# EasyEDA Pro project keyboard_hewis.epro, board Cockpit
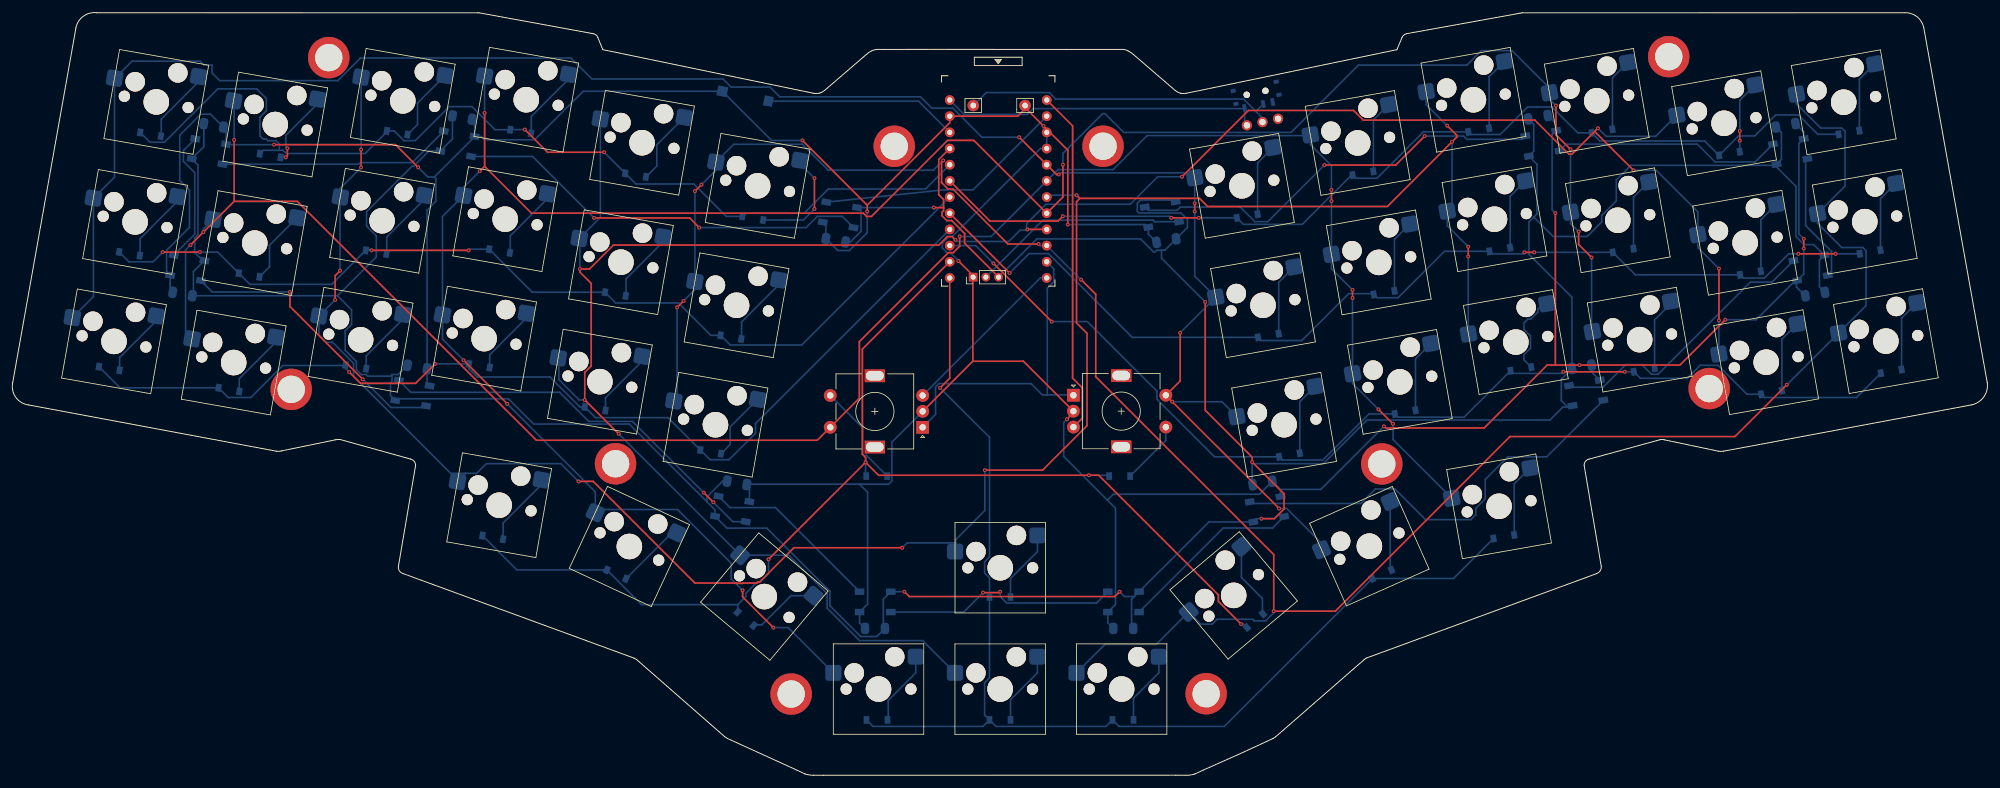
[diagram p2: board, top side]
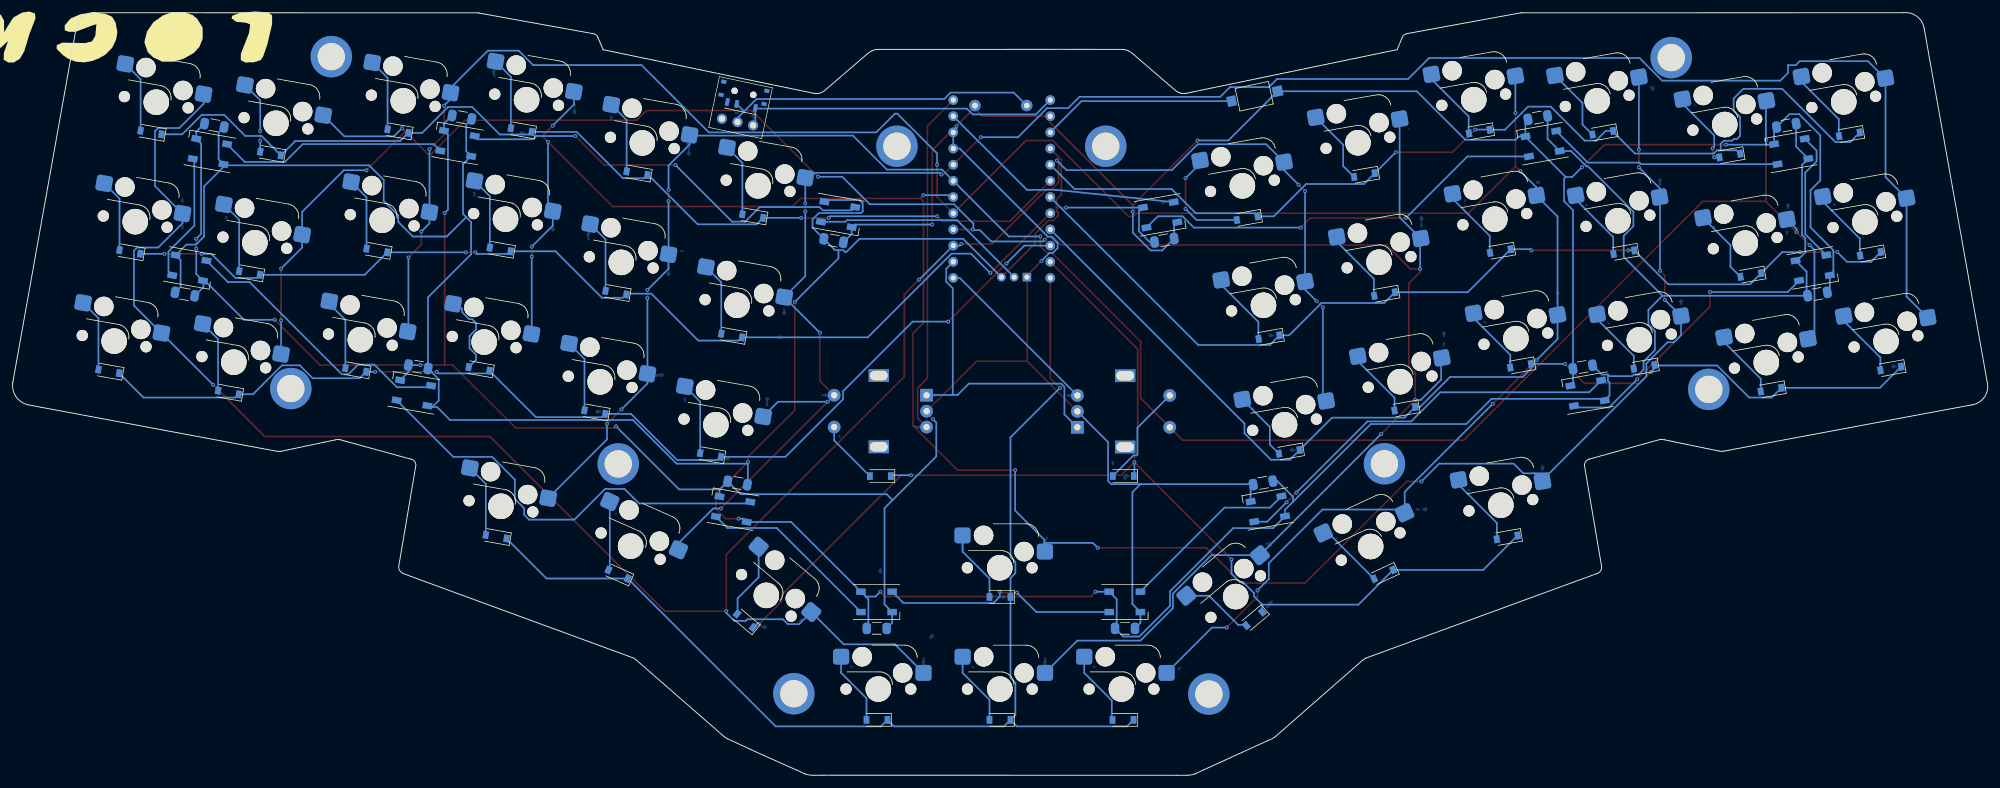
[diagram p3: board, bottom side, seen from below]

Outline 309.97 x 119.78 mm; copper layers: Top Layer, Bottom Layer. Coordinates in mm from the lower left corner of the outline.
Outline path: 2.49,58.17 arc(0.51,59.41) 0.07,61.7 9.99,117.41 arc(11.16,119.22) 13.25,119.76 73,119.75 73.26,119.75 91.15,116.47 arc(91.58,116.29) 91.87,115.92 92.68,113.96 125.75,107.11 arc(126.21,107.07) 126.67,107.13 arc(127.08,107.29) 127.45,107.53 134.02,113.19 arc(134.43,113.52) 134.9,113.79 arc(135.36,113.94) 135.84,114 136.86,114 144.66,114.01 165.44,114 174.13,114 arc(174.61,113.95) 175.07,113.79 arc(175.53,113.52) 175.95,113.19 182.52,107.53 arc(182.9,107.28) 183.33,107.11 arc(183.77,107.07) 184.22,107.11 217.29,113.96 218.1,115.87 arc(218.39,116.26) 218.82,116.47 236.65,119.69 236.97,119.75 297.02,119.76 arc(298.93,119.13) 299.98,117.41 309.94,61.66 arc(309.4,59.42) 307.47,58.17 268.51,50.89 arc(268.13,50.87) 267.75,50.89 259.27,52.68 arc(258.89,52.74) 258.51,52.68 247.48,49.66 arc(246.9,49.32) 246.68,48.68 249.36,32.82 arc(249.2,32.13) 248.64,31.68 212.48,18.4 212.06,18.08 198.27,6.05 197.89,5.8 192.45,3.28 186.89,0.81 185.58,0.2 arc(184.89,0.04) 184.18,0 182.6,0.01 127.34,0 125.79,0 arc(125.08,0.05) 124.39,0.21 123.12,0.81 112.23,5.78 111.81,6.06 97.98,18.17 97.55,18.41 61.33,31.68 arc(60.74,32.13) 60.61,32.87 63.29,48.68 arc(63.06,49.32) 62.49,49.66 51.46,52.72 arc(51.08,52.74) 50.7,52.68 42.22,50.94 arc(41.84,50.87) 41.46,50.9 2.49,58.17
Stack: Top Layer 0.0009mm / dielectric 1 0.0384mm FR4 er 4.5 / Bottom Layer 0.0009mm

## Design rules (mm)
spacing safeClearance (default): track to track 0.152, other pairs 0.152 to 0.3
track width trackWidth (default): min 0.127, default 0.254, max 2.54
differential pair differentialPair (default): width min 0.127, default 0.254, max 2.54; gap min 0.152, default 0.152
via viaSize (default): diameter min 0.5, default 0.61, max 10; hole min 0.3, default 0.305, max 6
net COL3 uses CopperRegion517
net ROW6 uses CopperRegion506
net Net-(J2-Pad1) uses CopperRegion393
net COL2 uses CopperRegion507
net RAW uses CopperRegion371
net COL1 uses CopperRegion491
net COL5 uses CopperRegion503
net RST uses CopperRegion444
net COL0 uses CopperRegion471
net Net-(D38-Pad2) uses CopperRegion384
net ROW5 uses CopperRegion438
net COL4 uses CopperRegion482
net ROW0 uses CopperRegion509
net D3 uses CopperRegion355
net ROW1 uses CopperRegion514
net ROW4 uses CopperRegion515
net ROW7 uses CopperRegion502
net D2 uses CopperRegion419
net DOUT uses CopperRegion493
net ROW3 uses CopperRegion485
net ROW2 uses CopperRegion513
net GND uses CopperRegion111
net VCC uses CopperRegion511
net Net-(D33-Pad2) uses CopperRegion294
net Net-(D4-Pad2) uses CopperRegion504
net Net-(D14-Pad2) uses CopperRegion167
net Net-(D28-Pad2) uses CopperRegion210
net Net-(D25-Pad2) uses CopperRegion228
net Net-(LED8-Pad2) uses CopperRegion290
net Net-(LED3-Pad2) uses CopperRegion310
net Net-(D19-Pad2) uses CopperRegion490
net Net-(D46-Pad2) uses CopperRegion293
net Net-(D17-Pad2) uses CopperRegion462
net Net-(D43-Pad2) uses CopperRegion353
net Net-(LED4-Pad2) uses CopperRegion499
net B4 uses CopperRegion436
net Net-(D30-Pad2) uses CopperRegion356
net Net-(D15-Pad2) uses CopperRegion501
net Net-(D24-Pad2) uses CopperRegion257
net Net-(LED12-Pad2) uses CopperRegion318
net Net-(D7-Pad2) uses CopperRegion410
net Net-(LED10-Pad2) uses CopperRegion373
net Net-(D1-Pad2) uses CopperRegion279
net Net-(LED7-Pad2) uses CopperRegion241
net Net-(D12-Pad2) uses CopperRegion272
net Net-(D48-Pad2) uses CopperRegion320
net Net-(D35-Pad2) uses CopperRegion285
net Net-(LED11-Pad2) uses CopperRegion466
net Net-(LED5-Pad2) uses CopperRegion483
net Net-(LED13-Pad2) uses CopperRegion251
net Net-(D36-Pad2) uses CopperRegion344
net Net-(D5-Pad2) uses CopperRegion447
net Net-(D20-Pad2) uses CopperRegion467
net Net-(D31-Pad2) uses CopperRegion337
net Net-(D26-Pad2) uses CopperRegion327
net Net-(LED10-Pad4) uses CopperRegion339
net Net-(D47-Pad2) uses CopperRegion232
net Net-(D39-Pad2) uses CopperRegion488
net Net-(D32-Pad2) uses CopperRegion431
net Net-(D45-Pad2) uses CopperRegion382
net Net-(D10-Pad2) uses CopperRegion246
net Net-(D44-Pad2) uses CopperRegion335
net Net-(D22-Pad2) uses CopperRegion305
net Net-(D8-Pad2) uses CopperRegion454
net Net-(LED1-Pad2) uses CopperRegion324
net Net-(D27-Pad2) uses CopperRegion306
net Net-(D9-Pad2) uses CopperRegion401
net Net-(D21-Pad2) uses CopperRegion400
net Net-(LED6-Pad2) uses CopperRegion346
net Net-(D42-Pad2) uses CopperRegion407
net Net-(D40-Pad2) uses CopperRegion430
net Net-(D23-Pad2) uses CopperRegion457
net Net-(D6-Pad2) uses CopperRegion480
net Net-(D18-Pad2) uses CopperRegion425
net B5 uses CopperRegion481
net Net-(LED2-Pad2) uses CopperRegion477
net Net-(D11-Pad2) uses CopperRegion443
net Net-(D41-Pad2) uses CopperRegion363
net Net-(D37-Pad2) uses CopperRegion381
net Net-(D2-Pad2) uses CopperRegion487
net Net-(D3-Pad2) uses CopperRegion440
net Net-(D16-Pad2) uses CopperRegion508
net Net-(D34-Pad2) uses CopperRegion516
net Net-(D29-Pad2) uses CopperRegion475
net Net-(D13-Pad2) uses CopperRegion426
pour ie2712 uses CopperRegion162
pour ie2713 uses CopperRegion200
pour ie2714 uses CopperRegion436
pour ie2715 uses CopperRegion317
pour ie2723 uses CopperRegion160
pour ie2726 uses CopperRegion220
pour ie2727 uses CopperRegion227
pour ie2728 uses CopperRegion248
pour ie2730 uses CopperRegion309
pour ie2740 uses CopperRegion471
pour ie2753 uses CopperRegion185
pour ie2754 uses CopperRegion187
pour ie2755 uses CopperRegion193
pour ie2757 uses CopperRegion235
pour ie2758 uses CopperRegion252
pour ie2759 uses CopperRegion323
pour ie2760 uses CopperRegion343
pour ie2761 uses CopperRegion351
pour ie2765 uses CopperRegion403
pour ie2768 uses CopperRegion459
pour ie2770 uses CopperRegion491
pour ie2783 uses CopperRegion112
pour ie2785 uses CopperRegion263
pour ie2787 uses CopperRegion283
pour ie2789 uses CopperRegion348
pour ie2791 uses CopperRegion388
pour ie2792 uses CopperRegion402
pour ie2793 uses CopperRegion411
pour ie2794 uses CopperRegion413
pour ie2797 uses CopperRegion473
pour ie2798 uses CopperRegion474
pour ie2799 uses CopperRegion478
pour ie2800 uses CopperRegion507
pour ie2813 uses CopperRegion118
pour ie2815 uses CopperRegion172
pour ie2819 uses CopperRegion261
pour ie2820 uses CopperRegion286
pour ie2821 uses CopperRegion287
pour ie2828 uses CopperRegion489
pour ie2829 uses CopperRegion498
pour ie2842 uses CopperRegion126
pour ie2844 uses CopperRegion146
pour ie2845 uses CopperRegion211
pour ie2846 uses CopperRegion231
pour ie2847 uses CopperRegion231
pour ie2848 uses CopperRegion231
pour ie2849 uses CopperRegion234
pour ie2853 uses CopperRegion301
pour ie2855 uses CopperRegion405
pour ie2857 uses CopperRegion420
pour ie2867 uses CopperRegion119
pour ie2870 uses CopperRegion250
pour ie2873 uses CopperRegion277
pour ie2875 uses CopperRegion347
pour ie2878 uses CopperRegion391
pour ie2881 uses CopperRegion484
pour ie2882 uses CopperRegion503
pour ie2885 uses CopperRegion416
pour ie2886 uses CopperRegion419
pour ie2889 uses CopperRegion114
pour ie2894 uses CopperRegion265
pour ie2895 uses CopperRegion292
pour ie2898 uses CopperRegion279
pour ie2902 uses CopperRegion246
pour ie2906 uses CopperRegion272
pour ie2907 uses CopperRegion424
pour ie2908 uses CopperRegion426
pour ie2909 uses CopperRegion123
pour ie2910 uses CopperRegion167
pour ie2911 uses CopperRegion152
pour ie2912 uses CopperRegion501
pour ie2913 uses CopperRegion399
pour ie2914 uses CopperRegion508
pour ie2915 uses CopperRegion144
pour ie2917 uses CopperRegion315
pour ie2919 uses CopperRegion139
pour ie2920 uses CopperRegion490
pour ie2921 uses CopperRegion365
pour ie2922 uses CopperRegion487
pour ie2923 uses CopperRegion207
pour ie2924 uses CopperRegion467
pour ie2925 uses CopperRegion289
pour ie2926 uses CopperRegion400
pour ie2929 uses CopperRegion308
pour ie2930 uses CopperRegion457
pour ie2931 uses CopperRegion153
pour ie2933 uses CopperRegion125
pour ie2936 uses CopperRegion327
pour ie2937 uses CopperRegion282
pour ie2938 uses CopperRegion306
pour ie2939 uses CopperRegion124
pour ie2940 uses CopperRegion210
pour ie2941 uses CopperRegion423
pour ie2943 uses CopperRegion380
pour ie2944 uses CopperRegion440
pour ie2945 uses CopperRegion150
pour ie2946 uses CopperRegion356
pour ie2947 uses CopperRegion208
pour ie2948 uses CopperRegion337
pour ie2949 uses CopperRegion229
pour ie2953 uses CopperRegion408
pour ie2955 uses CopperRegion183
pour ie2959 uses CopperRegion361
pour ie2960 uses CopperRegion381
pour ie2963 uses CopperRegion370
pour ie2964 uses CopperRegion384
pour ie2965 uses CopperRegion226
pour ie2966 uses CopperRegion488
pour ie2968 uses CopperRegion504
pour ie2969 uses CopperRegion303
pour ie2970 uses CopperRegion430
pour ie2971 uses CopperRegion341
pour ie2972 uses CopperRegion363
pour ie2973 uses CopperRegion300
pour ie2974 uses CopperRegion407
pour ie2975 uses CopperRegion147
pour ie2976 uses CopperRegion353
pour ie2977 uses CopperRegion247
pour ie2979 uses CopperRegion239
pour ie2980 uses CopperRegion382
pour ie2981 uses CopperRegion140
pour ie2982 uses CopperRegion293
pour ie2983 uses CopperRegion216
pour ie2984 uses CopperRegion232
pour ie2985 uses CopperRegion178
pour ie2986 uses CopperRegion320
pour ie2988 uses CopperRegion447
pour ie2989 uses CopperRegion313
pour ie2991 uses CopperRegion163
pour ie2992 uses CopperRegion410
pour ie2993 uses CopperRegion260
pour ie2994 uses CopperRegion454
pour ie2995 uses CopperRegion288
pour ie2996 uses CopperRegion401
pour ie2999 uses CopperRegion393
pour ie3000 uses CopperRegion266
pour ie3001 uses CopperRegion324
pour ie3002 uses CopperRegion166
pour ie3003 uses CopperRegion373
pour ie3004 uses CopperRegion214
pour ie3005 uses CopperRegion339
pour ie3006 uses CopperRegion189
pour ie3007 uses CopperRegion466
pour ie3008 uses CopperRegion155
pour ie3009 uses CopperRegion318
pour ie3010 uses CopperRegion191
pour ie3011 uses CopperRegion251
pour ie3012 uses CopperRegion325
pour ie3013 uses CopperRegion477
pour ie3014 uses CopperRegion132
pour ie3015 uses CopperRegion310
pour ie3016 uses CopperRegion148
pour ie3017 uses CopperRegion499
pour ie3018 uses CopperRegion190
pour ie3019 uses CopperRegion483
pour ie3020 uses CopperRegion299
pour ie3021 uses CopperRegion346
pour ie3022 uses CopperRegion174
pour ie3023 uses CopperRegion241
pour ie3024 uses CopperRegion129
pour ie3025 uses CopperRegion290
pour ie3028 uses CopperRegion371
pour ie3031 uses CopperRegion131
pour ie3032 uses CopperRegion184
pour ie3034 uses CopperRegion199
pour ie3035 uses CopperRegion222
pour ie3037 uses CopperRegion233
pour ie3039 uses CopperRegion418
pour ie3040 uses CopperRegion486
pour ie3041 uses CopperRegion500
pour ie3042 uses CopperRegion509
pour ie3049 uses CopperRegion122
pour ie3050 uses CopperRegion127
pour ie3051 uses CopperRegion137
pour ie3052 uses CopperRegion145
pour ie3053 uses CopperRegion197
pour ie3054 uses CopperRegion271
pour ie3055 uses CopperRegion296
pour ie3057 uses CopperRegion326
pour ie3060 uses CopperRegion422
pour ie3062 uses CopperRegion510
pour ie3069 uses CopperRegion142
pour ie3070 uses CopperRegion143
pour ie3072 uses CopperRegion159
pour ie3073 uses CopperRegion171
pour ie3075 uses CopperRegion221
pour ie3076 uses CopperRegion333
pour ie3077 uses CopperRegion369
pour ie3080 uses CopperRegion513
pour ie3085 uses CopperRegion116
pour ie3086 uses CopperRegion128
pour ie3087 uses CopperRegion130
pour ie3088 uses CopperRegion158
pour ie3089 uses CopperRegion164
pour ie3090 uses CopperRegion177
pour ie3091 uses CopperRegion196
pour ie3093 uses CopperRegion238
pour ie3094 uses CopperRegion377
pour ie3095 uses CopperRegion458
pour ie3096 uses CopperRegion485
pour ie3103 uses CopperRegion188
pour ie3104 uses CopperRegion224
pour ie3105 uses CopperRegion237
pour ie3106 uses CopperRegion307
pour ie3107 uses CopperRegion319
pour ie3110 uses CopperRegion375
pour ie3111 uses CopperRegion396
pour ie3112 uses CopperRegion433
pour ie3113 uses CopperRegion435
pour ie3114 uses CopperRegion446
pour ie3115 uses CopperRegion455
pour ie3116 uses CopperRegion470
pour ie3117 uses CopperRegion497
pour ie3118 uses CopperRegion515
pour ie3130 uses CopperRegion243
pour ie3131 uses CopperRegion276
pour ie3132 uses CopperRegion284
pour ie3136 uses CopperRegion385
pour ie3137 uses CopperRegion390
pour ie3147 uses CopperRegion115
pour ie3148 uses CopperRegion141
pour ie3149 uses CopperRegion161
pour ie3150 uses CopperRegion170
pour ie3152 uses CopperRegion274
pour ie3153 uses CopperRegion311
pour ie3154 uses CopperRegion345
pour ie3155 uses CopperRegion357
pour ie3156 uses CopperRegion359
pour ie3157 uses CopperRegion398
pour ie3158 uses CopperRegion463
pour ie3159 uses CopperRegion472
pour ie3160 uses CopperRegion506
pour ie3163 uses CopperRegion173
pour ie3164 uses CopperRegion218
pour ie3169 uses CopperRegion415
pour ie3170 uses CopperRegion442
pour ie3171 uses CopperRegion449
pour ie3172 uses CopperRegion502
pour ie3176 uses CopperRegion444
pour ie3178 uses CopperRegion133
pour ie3179 uses CopperRegion135
pour ie3180 uses CopperRegion136
pour ie3181 uses CopperRegion138
pour ie3182 uses CopperRegion151
pour ie3183 uses CopperRegion156
pour ie3184 uses CopperRegion182
pour ie3185 uses CopperRegion186
pour ie3186 uses CopperRegion204
pour ie3187 uses CopperRegion205
pour ie3188 uses CopperRegion206
pour ie3189 uses CopperRegion213
pour ie3190 uses CopperRegion215
pour ie3191 uses CopperRegion219
pour ie3192 uses CopperRegion230
pour ie3193 uses CopperRegion245
pour ie3194 uses CopperRegion249
pour ie3196 uses CopperRegion259
pour ie3197 uses CopperRegion262
pour ie3198 uses CopperRegion269
pour ie3199 uses CopperRegion273
pour ie3200 uses CopperRegion275
pour ie3202 uses CopperRegion281
pour ie3203 uses CopperRegion297
pour ie3204 uses CopperRegion302
pour ie3207 uses CopperRegion328
pour ie3208 uses CopperRegion329
pour ie3209 uses CopperRegion331
pour ie3210 uses CopperRegion332
pour ie3212 uses CopperRegion354
pour ie3213 uses CopperRegion362
pour ie3216 uses CopperRegion376
pour ie3217 uses CopperRegion389
pour ie3218 uses CopperRegion395
pour ie3219 uses CopperRegion417
pour ie3222 uses CopperRegion429
pour ie3223 uses CopperRegion434
pour ie3225 uses CopperRegion460
pour ie3226 uses CopperRegion465
pour ie3227 uses CopperRegion479
pour ie3229 uses CopperRegion505
pour ie3230 uses CopperRegion511

## Placement (name value [footprint] x y rotation side)
C1  C1206C105K5RACTU  [Capacitor_SMD:C_1206_3216Metric_Pad1.33x1.80mm_HandSolder]  129.22 84.02 350 bottom
C2  C1206C105K5RACTU  [Capacitor_SMD:C_1206_3216Metric_Pad1.33x1.80mm_HandSolder]  70.61 103.29 170 bottom
C3  C1206C105K5RACTU  [Capacitor_SMD:C_1206_3216Metric_Pad1.33x1.80mm_HandSolder]  31.6 102.07 170 bottom
C4  C1206C105K5RACTU  [Capacitor_SMD:C_1206_3216Metric_Pad1.33x1.80mm_HandSolder]  26.71 75.58 350 bottom
C5  C1206C105K5RACTU  [Capacitor_SMD:C_1206_3216Metric_Pad1.33x1.80mm_HandSolder]  63.55 64.12 170 bottom
C6  C1206C105K5RACTU  [Capacitor_SMD:C_1206_3216Metric_Pad1.33x1.80mm_HandSolder]  113.73 45.92 170 bottom
C7  C1206C105K5RACTU  [Capacitor_SMD:C_1206_3216Metric_Pad1.33x1.80mm_HandSolder]  135.39 23.06 0 bottom
C8  C1206C105K5RACTU  [Capacitor_SMD:C_1206_3216Metric_Pad1.33x1.80mm_HandSolder]  174.35 23.06 0 bottom
C9  C1206C105K5RACTU  [Capacitor_SMD:C_1206_3216Metric_Pad1.33x1.80mm_HandSolder]  196.2 45.9 190 bottom
C10  C1206C105K5RACTU  [Capacitor_SMD:C_1206_3216Metric_Pad1.33x1.80mm_HandSolder]  246.31 64.15 190 bottom
C11  C1206C105K5RACTU  [Capacitor_SMD:C_1206_3216Metric_Pad1.33x1.80mm_HandSolder]  282.92 75.57 10 bottom
C12  C1206C105K5RACTU  [Capacitor_SMD:C_1206_3216Metric_Pad1.33x1.80mm_HandSolder]  278.31 102.08 190 bottom
C13  C1206C105K5RACTU  [Capacitor_SMD:C_1206_3216Metric_Pad1.33x1.80mm_HandSolder]  239.45 103.35 190 bottom
C14  C1206C105K5RACTU  [Capacitor_SMD:C_1206_3216Metric_Pad1.33x1.80mm_HandSolder]  181.11 83.97 10 bottom
D1  1N4148W  [Diode_SMD:D_SOD-123]  21.7 100.66 350 bottom
D2  1N4148W  [Diode_SMD:D_SOD-123]  40.48 97.34 350 bottom
D3  1N4148W  [Diode_SMD:D_SOD-123]  60.4 100.92 350 bottom
D4  1N4148W  [Diode_SMD:D_SOD-123]  79.78 101.09 350 bottom
D5  1N4148W  [Diode_SMD:D_SOD-123]  97.81 94.26 350 bottom
D6  1N4148W  [Diode_SMD:D_SOD-123]  116.21 87.49 350 bottom
D7  1N4148W  [Diode_SMD:D_SOD-123]  193.81 87.83 10 bottom
D8  1N4148W  [Diode_SMD:D_SOD-123]  211.98 94.56 10 bottom
D9  1N4148W  [Diode_SMD:D_SOD-123]  230.14 101.34 10 bottom
D10  1N4148W  [Diode_SMD:D_SOD-123]  249.49 101.17 10 bottom
D11  1N4148W  [Diode_SMD:D_SOD-123]  269.47 97.64 10 bottom
D12  1N4148W  [Diode_SMD:D_SOD-123]  288.25 100.95 10 bottom
D13  1N4148W  [Diode_SMD:D_SOD-123]  18.39 81.9 350 bottom
D14  1N4148W  [Diode_SMD:D_SOD-123]  37.17 78.58 350 bottom
D15  1N4148W  [Diode_SMD:D_SOD-123]  57.09 82.15 350 bottom
D16  1N4148W  [Diode_SMD:D_SOD-123]  76.47 82.33 350 bottom
D17  1N4148W  [Diode_SMD:D_SOD-123]  94.64 75.58 350 bottom
D18  1N4148W  [Diode_SMD:D_SOD-123]  112.78 68.81 350 bottom
D19  1N4148W  [Diode_SMD:D_SOD-123]  197.12 69.06 10 bottom
D20  1N4148W  [Diode_SMD:D_SOD-123]  215.28 75.79 10 bottom
D21  1N4148W  [Diode_SMD:D_SOD-123]  233.45 82.58 10 bottom
D22  1N4148W  [Diode_SMD:D_SOD-123]  252.8 82.41 10 bottom
D23  1N4148W  [Diode_SMD:D_SOD-123]  272.78 78.88 10 bottom
D24  1N4148W  [Diode_SMD:D_SOD-123]  291.56 82.19 10 bottom
D25  1N4148W  [Diode_SMD:D_SOD-123]  15.21 63.89 350 bottom
D26  1N4148W  [Diode_SMD:D_SOD-123]  34 60.57 350 bottom
D27  1N4148W  [Diode_SMD:D_SOD-123]  53.92 64.14 350 bottom
D28  1N4148W  [Diode_SMD:D_SOD-123]  73.3 64.32 350 bottom
D29  1N4148W  [Diode_SMD:D_SOD-123]  91.46 57.57 350 bottom
D30  1N4148W  [Diode_SMD:D_SOD-123]  109.6 50.8 350 bottom
D31  1N4148W  [Diode_SMD:D_SOD-123]  200.43 50.3 10 bottom
D32  1N4148W  [Diode_SMD:D_SOD-123]  218.59 57.03 10 bottom
D33  1N4148W  [Diode_SMD:D_SOD-123]  236.75 63.82 10 bottom
D34  1N4148W  [Diode_SMD:D_SOD-123]  256.11 63.65 10 bottom
D35  1N4148W  [Diode_SMD:D_SOD-123]  276.09 60.12 10 bottom
D36  1N4148W  [Diode_SMD:D_SOD-123]  294.87 63.43 10 bottom
D37  1N4148W  [Diode_SMD:D_SOD-123]  173.78 46.99 0 bottom
D38  1N4148W  [Diode_SMD:D_SOD-123]  135.66 46.99 0 bottom
D39  1N4148W  [Diode_SMD:D_SOD-123]  75.4 37.37 350 bottom
D40  1N4148W  [Diode_SMD:D_SOD-123]  94.8 31.56 335 bottom
D41  1N4148W  [Diode_SMD:D_SOD-123]  115.09 24.57 320 bottom
D42  1N4148W  [Diode_SMD:D_SOD-123]  195.01 24.28 40 bottom
D43  1N4148W  [Diode_SMD:D_SOD-123]  214.94 31.57 24 bottom
D44  1N4148W  [Diode_SMD:D_SOD-123]  234.08 37.47 10 bottom
D45  1N4148W  [Diode_SMD:D_SOD-123]  155.01 28 0 bottom
D46  1N4148W  [Diode_SMD:D_SOD-123]  135.7 8.7 0 bottom
D47  1N4148W  [Diode_SMD:D_SOD-123]  155.01 8.7 0 bottom
D48  1N4148W  [Diode_SMD:D_SOD-123]  174.31 8.7 0 bottom
H1  MountingHole  [kbd:M2_HOLE]  214.92 48.9 0 top
H2  MountingHole  [kbd:M2_HOLE]  49.66 112.71 0 top
H3  MountingHole  [kbd:M2_HOLE]  259.95 112.86 0 top
H4  MountingHole  [kbd:M2_HOLE]  187.36 12.81 0 top
H5  MountingHole  [kbd:M2_HOLE]  122.23 12.76 0 top
H6  MountingHole  [kbd:M2_HOLE]  138.41 98.79 0 top
H7  MountingHole  [kbd:M2_HOLE]  94.67 48.92 0 top
H8  MountingHole  [kbd:M2_HOLE]  266.3 60.73 0 top
H9  MountingHole  [kbd:M2_HOLE]  43.77 60.61 0 top
H10  MountingHole  [kbd:M2_HOLE]  171.18 98.79 0 top
J1  Conn_01x01_Female  [Connector_Pin:Pin_D0.9mm_L10.0mm_W2.4mm_FlatFork]  158.94 105.18 0 top
J3  Conn_01x03_Female  [Connector_PinHeader_2.00mm:PinHeader_1x03_P2.00mm_Vertical]  150.79 78.23 90 top
JN  Conn_01x01_Female  [Connector_Pin:Pin_D0.9mm_L10.0mm_W2.4mm_FlatFork]  150.81 105.18 0 top
LED1  WS2812B  [LED_SMD:LED_WS2812B_PLCC4_5.0x5.0mm_P3.2mm]  129.88 88.01 170 bottom
LED2  WS2812B  [LED_SMD:LED_WS2812B_PLCC4_5.0x5.0mm_P3.2mm]  69.86 99.19 350 bottom
LED3  WS2812B  [LED_SMD:LED_WS2812B_PLCC4_5.0x5.0mm_P3.2mm]  30.85 97.97 350 bottom
LED4  WS2812B  [LED_SMD:LED_WS2812B_PLCC4_5.0x5.0mm_P3.2mm]  27.47 79.68 170 bottom
LED5  WS2812B  [LED_SMD:LED_WS2812B_PLCC4_5.0x5.0mm_P3.2mm]  62.8 60.02 350 bottom
LED6  WS2812B  [LED_SMD:LED_WS2812B_PLCC4_5.0x5.0mm_P3.2mm]  112.97 41.83 350 bottom
LED7  WS2812B  [LED_SMD:LED_WS2812B_PLCC4_5.0x5.0mm_P3.2mm]  135.42 27.23 180 bottom
LED8  WS2812B  [LED_SMD:LED_WS2812B_PLCC4_5.0x5.0mm_P3.2mm]  174.38 27.23 180 bottom
LED9  WS2812B  [LED_SMD:LED_WS2812B_PLCC4_5.0x5.0mm_P3.2mm]  196.89 41.79 10 bottom
LED10  WS2812B  [LED_SMD:LED_WS2812B_PLCC4_5.0x5.0mm_P3.2mm]  247 60.05 10 bottom
LED11  WS2812B  [LED_SMD:LED_WS2812B_PLCC4_5.0x5.0mm_P3.2mm]  282.23 79.68 190 bottom
LED12  WS2812B  [LED_SMD:LED_WS2812B_PLCC4_5.0x5.0mm_P3.2mm]  279 97.97 10 bottom
LED13  WS2812B  [LED_SMD:LED_WS2812B_PLCC4_5.0x5.0mm_P3.2mm]  240.14 99.24 10 bottom
LED14  WS2812B  [LED_SMD:LED_WS2812B_PLCC4_5.0x5.0mm_P3.2mm]  180.42 88.08 190 bottom
Reset1  SW_KBD  [kbd:SW_SPST_RS-282G05A3-SM]  115.01 106.67 168 bottom
SW1  MX_SW_HS  [Switch_Keyboard_Hotswap_Kailh:SW_Hotswap_Kailh_MX_1.00u]  22.6 105.75 350 top
SW2  MX_SW_HS  [Switch_Keyboard_Hotswap_Kailh:SW_Hotswap_Kailh_MX_1.00u]  41.27 102.2 350 top
SW3  MX_SW_HS  [Switch_Keyboard_Hotswap_Kailh:SW_Hotswap_Kailh_MX_1.00u]  61.28 105.92 350 top
SW4  MX_SW_HS  [Switch_Keyboard_Hotswap_Kailh:SW_Hotswap_Kailh_MX_1.00u]  80.66 106.1 350 top
SW5  MX_SW_HS  [Switch_Keyboard_Hotswap_Kailh:SW_Hotswap_Kailh_MX_1.00u]  98.83 99.34 350 top
SW6  MX_SW_HS  [Switch_Keyboard_Hotswap_Kailh:SW_Hotswap_Kailh_MX_1.00u]  116.97 92.57 350 top
SW7  MX_SW_HS  [Switch_Keyboard_Hotswap_Kailh:SW_Hotswap_Kailh_MX_1.00u]  192.98 92.58 10 top
SW8  MX_SW_HS  [Switch_Keyboard_Hotswap_Kailh:SW_Hotswap_Kailh_MX_1.00u]  211.14 99.31 10 top
SW9  MX_SW_HS  [Switch_Keyboard_Hotswap_Kailh:SW_Hotswap_Kailh_MX_1.00u]  229.3 106.09 10 top
SW10  MX_SW_HS  [Switch_Keyboard_Hotswap_Kailh:SW_Hotswap_Kailh_MX_1.00u]  248.65 105.93 10 top
SW11  MX_SW_HS  [Switch_Keyboard_Hotswap_Kailh:SW_Hotswap_Kailh_MX_1.00u]  268.64 102.4 10 top
SW12  MX_SW_HS  [Switch_Keyboard_Hotswap_Kailh:SW_Hotswap_Kailh_MX_1.00u]  287.41 105.71 10 top
SW13  MX_SW_HS  [Switch_Keyboard_Hotswap_Kailh:SW_Hotswap_Kailh_MX_1.00u]  19.27 86.9 350 top
SW14  MX_SW_HS  [Switch_Keyboard_Hotswap_Kailh:SW_Hotswap_Kailh_MX_1.00u]  38.05 83.58 350 top
SW15  MX_SW_HS  [Switch_Keyboard_Hotswap_Kailh:SW_Hotswap_Kailh_MX_1.00u]  58.03 87.09 350 top
SW16  MX_SW_HS  [Switch_Keyboard_Hotswap_Kailh:SW_Hotswap_Kailh_MX_1.00u]  77.36 87.34 350 top
SW17  MX_SW_HS  [Switch_Keyboard_Hotswap_Kailh:SW_Hotswap_Kailh_MX_1.00u]  95.52 80.58 350 top
SW18  MX_SW_HS  [Switch_Keyboard_Hotswap_Kailh:SW_Hotswap_Kailh_MX_1.00u]  113.66 73.81 350 top
SW19  MX_SW_HS  [Switch_Keyboard_Hotswap_Kailh:SW_Hotswap_Kailh_MX_1.00u]  196.28 73.82 10 top
SW20  MX_SW_HS  [Switch_Keyboard_Hotswap_Kailh:SW_Hotswap_Kailh_MX_1.00u]  214.45 80.55 10 top
SW21  MX_SW_HS  [Switch_Keyboard_Hotswap_Kailh:SW_Hotswap_Kailh_MX_1.00u]  232.61 87.33 10 top
SW22  MX_SW_HS  [Switch_Keyboard_Hotswap_Kailh:SW_Hotswap_Kailh_MX_1.00u]  251.96 87.17 10 top
SW23  MX_SW_HS  [Switch_Keyboard_Hotswap_Kailh:SW_Hotswap_Kailh_MX_1.00u]  271.94 83.64 10 top
SW24  MX_SW_HS  [Switch_Keyboard_Hotswap_Kailh:SW_Hotswap_Kailh_MX_1.00u]  290.72 86.95 10 top
SW25  MX_SW_HS  [Switch_Keyboard_Hotswap_Kailh:SW_Hotswap_Kailh_MX_1.00u]  15.96 68.14 350 top
SW26  MX_SW_HS  [Switch_Keyboard_Hotswap_Kailh:SW_Hotswap_Kailh_MX_1.00u]  34.75 64.82 350 top
SW27  MX_SW_HS  [Switch_Keyboard_Hotswap_Kailh:SW_Hotswap_Kailh_MX_1.00u]  54.67 68.4 350 top
SW28  MX_SW_HS  [Switch_Keyboard_Hotswap_Kailh:SW_Hotswap_Kailh_MX_1.00u]  74.05 68.57 350 top
SW29  MX_SW_HS  [Switch_Keyboard_Hotswap_Kailh:SW_Hotswap_Kailh_MX_1.00u]  92.21 61.82 350 top
SW30  MX_SW_HS  [Switch_Keyboard_Hotswap_Kailh:SW_Hotswap_Kailh_MX_1.00u]  110.35 55.05 350 top
SW31  MX_SW_HS  [Switch_Keyboard_Hotswap_Kailh:SW_Hotswap_Kailh_MX_1.00u]  199.59 55.06 10 top
SW32  MX_SW_HS  [Switch_Keyboard_Hotswap_Kailh:SW_Hotswap_Kailh_MX_1.00u]  217.75 61.79 10 top
SW33  MX_SW_HS  [Switch_Keyboard_Hotswap_Kailh:SW_Hotswap_Kailh_MX_1.00u]  235.96 68.04 10 top
SW34  MX_SW_HS  [Switch_Keyboard_Hotswap_Kailh:SW_Hotswap_Kailh_MX_1.00u]  255.39 68.42 10 top
SW35  MX_SW_HS  [Switch_Keyboard_Hotswap_Kailh:SW_Hotswap_Kailh_MX_1.00u]  275.25 64.88 10 top
SW36  MX_SW_HS  [Switch_Keyboard_Hotswap_Kailh:SW_Hotswap_Kailh_MX_1.00u]  294.03 68.18 10 top
SW37  RotaryEncoder_Switch  [Rotary_Encoder:RotaryEncoder_Alps_EC11E-Switch_Vertical_H20mm]  166.53 59.68 0 top
SW38  RotaryEncoder_Switch  [Rotary_Encoder:RotaryEncoder_Alps_EC11E-Switch_Vertical_H20mm]  142.87 54.65 180 top
SW39  MX_SW_HS  [Switch_Keyboard_Hotswap_Kailh:SW_Hotswap_Kailh_MX_1.00u]  76.41 42.41 350 top
SW40  MX_SW_HS  [Switch_Keyboard_Hotswap_Kailh:SW_Hotswap_Kailh_MX_1.00u]  96.84 35.93 335 top
SW41  MX_SW_HS  [Switch_Keyboard_Hotswap_Kailh:SW_Hotswap_Kailh_MX_1.50u_90deg]  118.02 28.06 320 top
SW42  MX_SW_HS  [Switch_Keyboard_Hotswap_Kailh:SW_Hotswap_Kailh_MX_1.50u_90deg]  191.68 28.25 40 top
SW43  MX_SW_HS  [Switch_Keyboard_Hotswap_Kailh:SW_Hotswap_Kailh_MX_1.00u]  212.98 35.98 24 top
SW44  MX_SW_HS  [Switch_Keyboard_Hotswap_Kailh:SW_Hotswap_Kailh_MX_1.00u]  233.33 42.24 10 top
SW45  MX_SW_HS  [Switch_Keyboard_Hotswap_Kailh:SW_Hotswap_Kailh_MX_1.00u]  155.05 32.59 0 top
SW46  MX_SW_HS  [Switch_Keyboard_Hotswap_Kailh:SW_Hotswap_Kailh_MX_1.00u]  135.94 13.54 0 top
SW47  MX_SW_HS  [Switch_Keyboard_Hotswap_Kailh:SW_Hotswap_Kailh_MX_1.00u]  155.03 13.53 0 top
SW48  MX_SW_HS  [Switch_Keyboard_Hotswap_Kailh:SW_Hotswap_Kailh_MX_1.00u]  174.1 13.54 0 top
SW49  MSK12C02  [kbd:MSK12C02]  196.33 105.43 12 bottom
SW_TOG1  SS12D00  [kbd:SS12D00]  196.2 102.59 12 bottom
U1  ProMicro  [kbd:ProMicro_v3.5]  154.73 91.57 0 top

## Footprints (pads in the part's own frame, mm; a bottom-side part is the same pattern mirrored in y, then rotated)
Capacitor_SMD:C_1206_3216Metric_Pad1.33x1.80mm_HandSolder
  rrect 1.325x1.8 smd: 1(-1.562,0) 2(1.562,0)
Connector_Pin:Pin_D0.9mm_L10.0mm_W2.4mm_FlatFork
  round 1.8 hole 0.9: 1(0,0)
Connector_PinHeader_2.00mm:PinHeader_1x03_P2.00mm_Vertical
  rect 1.35x1.35 hole 0.8: 1(0,0)
  round 1.35 hole 0.8: 2(0,-2) 3(0,-4)
Diode_SMD:D_SOD-123
  rect 0.9x1.2 smd: 1(-1.65,0) 2(1.65,0)
kbd:M2_HOLE
  round 6.5 hole 4.3: (0,0)
kbd:MSK12C02
  rect 0.8x0.6 smd: (-4.2,-3) (-4.2,-0.9) (2.7,-3) (2.7,-0.9)
  round 1 hole 1: (-2.25,-1.95) (0.75,-1.95)
  rect 0.6x1.2 smd: 1(1.5,0) 2(0,0) 3(-3,0)
kbd:ProMicro_v3.5
  round 1.524 hole 0.813: 1(7.612,14.478) 2(7.612,11.938) 3(7.612,9.398) 4(7.612,6.858) 5(7.612,4.318) 6(7.612,1.778) 7(7.612,-0.762) 8(7.612,-3.302) 9(7.612,-5.842) 10(7.612,-8.382) 11(7.612,-10.922) 12(7.612,-13.462) 13(-7.609,-13.462) 14(-7.609,-10.922) 15(-7.609,-8.382) 16(-7.609,-5.842) 17(-7.609,-3.302) 18(-7.609,-0.762) 19(-7.609,1.778) 20(-7.609,4.318) 21(-7.609,6.858) 22(-7.609,9.398) 23(-7.609,11.938) 24(-7.609,14.478)
kbd:SS12D00
  round 1.6 hole 1: 1(-2.5,0) 2(0,0) 3(2.5,0)
kbd:SW_SPST_RS-282G05A3-SM
  rect 1.435x1.59 smd: 1(-3.728,-0.025)
  rect 1.595x1.6 smd: 2(3.647,-0.01)
LED_SMD:LED_WS2812B_PLCC4_5.0x5.0mm_P3.2mm
  rect 1.5x1 smd: 1(-2.45,1.6) 2(-2.45,-1.6) 3(2.45,-1.6) 4(2.45,1.6)
Rotary_Encoder:RotaryEncoder_Alps_EC11E-Switch_Vertical_H20mm
  rect 2x2 hole 1: A(0,0)
  round 2 hole 1: B(0,-5) C(0,-2.5) S1(14.5,-5) S2(14.5,0)
  rect 3.2x2 hole 2.8x1.5: MP(7.5,3.1) MP(7.5,-8.1)
Switch_Keyboard_Hotswap_Kailh:SW_Hotswap_Kailh_MX_1.00u
  round 1.75 hole 1.75: (-5.08,0) (5.08,0)
  round 3.05 hole 3.05: (-3.81,2.54) (2.54,5.08)
  round 4 hole 4: (0,0)
  rrect 2.55x2.5 smd far side: 1(-7.085,2.54) 2(5.842,5.08)
Switch_Keyboard_Hotswap_Kailh:SW_Hotswap_Kailh_MX_1.50u_90deg
  round 1.75 hole 1.75: (-5.08,0) (5.08,0)
  round 3.05 hole 3.05: (-3.81,2.54) (2.54,5.08)
  round 4 hole 4: (0,0)
  rrect 2.55x2.5 smd far side: 1(-7.085,2.54) 2(5.842,5.08)

## Nets
GND: C1.1 C2.1 C3.1 C4.1 C5.1 C6.1 C7.1 C8.1 C9.1 C10.1 C11.1 C12.1 C13.1 C14.1 J1.1 J3.1 LED1.3 LED2.3 LED3.3 LED4.3 LED5.3 LED6.3 LED7.3 LED8.3 LED9.3 LED10.3 LED11.3 LED12.3 LED13.3 LED14.3 Reset1.2 SW37.C SW38.C U1.3 U1.4 U1.23
VCC: C1.2 C2.2 C3.2 C4.2 C5.2 C6.2 C7.2 C8.2 C9.2 C10.2 C11.2 C12.2 C13.2 C14.2 J3.3 LED1.1 LED2.1 LED3.1 LED4.1 LED5.1 LED6.1 LED7.1 LED8.1 LED9.1 LED10.1 LED11.1 LED12.1 LED13.1 LED14.1 U1.21
B4: SW37.A SW38.A U1.11
B5: SW38.B U1.12
COL0: SW1.1 SW7.1 SW13.1 SW19.1 SW25.1 SW31.1 SW37.S2 SW43.1 U1.5
COL1: SW2.1 SW8.1 SW14.1 SW20.1 SW26.1 SW32.1 SW38.S2 SW44.1 U1.6
COL2: SW3.1 SW9.1 SW15.1 SW21.1 SW27.1 SW33.1 SW39.1 SW45.1 U1.7
COL3: SW4.1 SW10.1 SW16.1 SW22.1 SW28.1 SW34.1 SW40.1 SW46.1 U1.8
COL4: SW5.1 SW11.1 SW17.1 SW23.1 SW29.1 SW35.1 SW41.1 SW47.1 U1.9
COL5: SW6.1 SW12.1 SW18.1 SW24.1 SW30.1 SW36.1 SW42.1 SW48.1 U1.10
D2: LED1.4 U1.2
D3: SW37.B U1.1
DOUT: J3.2 LED14.2
NET-(D1-PAD2): D1.2 SW1.2
NET-(D2-PAD2): D2.2 SW2.2
NET-(D3-PAD2): D3.2 SW3.2
NET-(D4-PAD2): D4.2 SW4.2
NET-(D5-PAD2): D5.2 SW5.2
NET-(D6-PAD2): D6.2 SW6.2
NET-(D7-PAD2): D7.2 SW7.2
NET-(D8-PAD2): D8.2 SW8.2
NET-(D9-PAD2): D9.2 SW9.2
NET-(D10-PAD2): D10.2 SW10.2
NET-(D11-PAD2): D11.2 SW11.2
NET-(D12-PAD2): D12.2 SW12.2
NET-(D13-PAD2): D13.2 SW13.2
NET-(D14-PAD2): D14.2 SW14.2
NET-(D15-PAD2): D15.2 SW15.2
NET-(D16-PAD2): D16.2 SW16.2
NET-(D17-PAD2): D17.2 SW17.2
NET-(D18-PAD2): D18.2 SW18.2
NET-(D19-PAD2): D19.2 SW19.2
NET-(D20-PAD2): D20.2 SW20.2
NET-(D21-PAD2): D21.2 SW21.2
NET-(D22-PAD2): D22.2 SW22.2
NET-(D23-PAD2): D23.2 SW23.2
NET-(D24-PAD2): D24.2 SW24.2
NET-(D25-PAD2): D25.2 SW25.2
NET-(D26-PAD2): D26.2 SW26.2
NET-(D27-PAD2): D27.2 SW27.2
NET-(D28-PAD2): D28.2 SW28.2
NET-(D29-PAD2): D29.2 SW29.2
NET-(D30-PAD2): D30.2 SW30.2
NET-(D31-PAD2): D31.2 SW31.2
NET-(D32-PAD2): D32.2 SW32.2
NET-(D33-PAD2): D33.2 SW33.2
NET-(D34-PAD2): D34.2 SW34.2
NET-(D35-PAD2): D35.2 SW35.2
NET-(D36-PAD2): D36.2 SW36.2
NET-(D37-PAD2): D37.2 SW37.S1
NET-(D38-PAD2): D38.2 SW38.S1
NET-(D39-PAD2): D39.2 SW39.2
NET-(D40-PAD2): D40.2 SW40.2
NET-(D41-PAD2): D41.2 SW41.2
NET-(D42-PAD2): D42.2 SW42.2
NET-(D43-PAD2): D43.2 SW43.2
NET-(D44-PAD2): D44.2 SW44.2
NET-(D45-PAD2): D45.2 SW45.2
NET-(D46-PAD2): D46.2 SW46.2
NET-(D47-PAD2): D47.2 SW47.2
NET-(D48-PAD2): D48.2 SW48.2
NET-(J2-PAD1): JN.1 SW49.2 SW_TOG1.2
NET-(LED1-PAD2): LED1.2 LED2.4
NET-(LED2-PAD2): LED2.2 LED3.4
NET-(LED3-PAD2): LED3.2 LED4.4
NET-(LED4-PAD2): LED4.2 LED5.4
NET-(LED5-PAD2): LED5.2 LED6.4
NET-(LED6-PAD2): LED6.2 LED7.4
NET-(LED7-PAD2): LED7.2 LED8.4
NET-(LED8-PAD2): LED8.2 LED9.4
NET-(LED10-PAD2): LED10.2 LED11.4
NET-(LED10-PAD4): LED9.2 LED10.4
NET-(LED11-PAD2): LED11.2 LED12.4
NET-(LED12-PAD2): LED12.2 LED13.4
NET-(LED13-PAD2): LED13.2 LED14.4
RAW: SW49.3 SW_TOG1.1 U1.24
ROW0: D1.1 D2.1 D3.1 D4.1 D5.1 D6.1 U1.20
ROW1: D7.1 D8.1 D9.1 D10.1 D11.1 D12.1 U1.19
ROW2: D13.1 D14.1 D15.1 D16.1 D17.1 D18.1 U1.18
ROW3: D19.1 D20.1 D21.1 D22.1 D23.1 D24.1 U1.17
ROW4: D25.1 D26.1 D27.1 D28.1 D29.1 D30.1 U1.16
ROW5: D31.1 D32.1 D33.1 D34.1 D35.1 D36.1 U1.15
ROW6: D37.1 D38.1 D39.1 D40.1 D41.1 D42.1 U1.14
ROW7: D43.1 D44.1 D45.1 D46.1 D47.1 D48.1 U1.13
RST: Reset1.1 U1.22
UNCONNECTED-(SW49-PAD1): SW49.1
UNCONNECTED-(SW_TOG1-PAD3): SW_TOG1.3

Pads without a net: SW37 MP; SW38 MP

## Via types
v1: diameter 0.61, hole 0.305, Top Layer to Bottom Layer, 120 vias

## Routing (per net, layer and track width the routed paths; a pad name or vN(x,y) marks a point on that pad's centre or on a via; arc(x,y) is an arc through that point)
GND: length 654.3
  Top Layer w0.254: 134.16,89.54 147.12,102.49 U1.23 157.77,103.51 159.04,104.78 ; 134.16,89.54 v1(124,99.7) ; 134.16,89.54 v1(134.16,88.52) ; J1.1 159.04,105.08 159.04,104.78 ; v1(148.5,80.77) 150.78,78.49 J3.1 150.74,78.19 150.74,65.02 ; 159.04,104.78 v1(161.83,101.98) 165.64,98.17 v1(165.64,86.49) ; 150.74,65.02 SW38.C ; 150.74,65.02 158.68,65.02 SW37.C 166.53,56.93 v1(165.51,55.91) ; v1(281.14,82.73) v1(281.14,84.25) ; 242.15,64.42 v1(245.96,64.42) 261.71,64.42 v1(268.82,71.54) ; 242.15,64.42 v1(242.15,88.3) ; 242.15,64.42 240.88,64.42 231.01,54.55 215.52,54.55 v1(215.26,54.8) ; v1(63.69,95.48) 60.13,99.04 v1(41.08,99.04)
  Bottom Layer w0.254: v1(215.26,54.8) 205.36,44.9 199.01,44.9 ; 25.17,75.85 24.78,76.25 LED4.3 24.22,79.08 24.22,82.46 27.8,86.05 27.8,91.89 26.28,93.41 26.28,100.52 29.58,103.83 31.1,103.83 C3.1 33.53,101.4 LED3.3 33.61,99.04 v1(41.08,99.04) ; C2.1 72.55,102.61 72.55,100.34 72.58,100.31 ; LED1.3 127.68,86.37 C1.1 129.55,82.42 131.37,82.42 134.16,85.22 v1(134.16,88.52) ; 132.96,45.72 134.23,44.45 134.23,26.89 LED7.3 132.97,23.92 C7.1 ; 132.96,45.72 115.69,45.72 ; 132.96,45.72 137.53,45.72 138.04,46.23 138.04,52.32 SW38.C ; 115.26,45.65 115.33,45.72 115.69,45.72 ; 280,77.63 279.75,77.63 273.65,71.54 v1(268.82,71.54) ; 280,77.63 280.04,77.63 LED11.3 281.14,78.72 v1(281.14,82.73) ; 280,77.63 280,76.68 C11.1 ; 115.69,45.72 115.69,43 115.66,42.98 ; LED5.3 65.09,61.57 65.09,88.76 66.48,90.15 66.48,93.71 66.23,93.96 ; 72.58,100.31 66.23,93.96 ; 72.58,100.31 73.59,100.31 74.1,99.8 81.97,99.8 89.59,107.42 Reset1.2 119.16,99.7 v1(124,99.7) ; 66.23,93.96 65.21,93.96 v1(63.69,95.48) ; C14.1 178.28,84.99 LED14.3 177.87,86.49 v1(165.64,86.49) ; v1(148.5,80.77) 147.23,82.04 146.72,82.04 145.96,82.8 145.96,83.57 146.97,84.58 147.48,84.58 161.33,98.43 U1.4 162.34,100.97 161.83,101.47 v1(161.83,101.98) ; 171.86,43.21 172.79,44.14 195.71,44.14 C9.1 199.01,44.9 ; 171.86,43.21 173.13,41.94 173.13,26.83 LED8.3 171.93,23.92 C8.1 ; 171.86,43.21 165,50.07 165,55.4 v1(165.51,55.91) ; LED10.3 247.84,63.34 C10.1 v1(245.96,64.42) ; v1(242.15,88.3) 241.65,88.81 241.65,100.61 242.28,101.24 242.28,102.33 C13.1 ; 199.01,44.9 199.01,43.81 LED9.3 ; C12.1 281.14,101.06 LED12.3 280.38,99.21 280.38,85.01 v1(281.14,84.25)
VCC: length 631.2
  Top Layer w0.254: 146.15,89.15 146.15,90.42 145.38,91.19 145.38,96.69 U1.21 ; 146.15,89.15 146.15,88.65 145.89,88.39 145.89,87.88 146.66,87.12 147.42,87.12 149.45,85.09 149.45,83.57 J3.3 ; 146.15,89.15 v1(144.62,89.15) ; v1(196.03,40.3) 198.06,40.3 199.58,41.82 199.58,44.19 v1(194.58,49.19) 194.58,49.95 187.21,57.32 v1(187.21,74.34) ; v1(173.78,28.83) 173.02,28.07 140.76,28.07 v1(140,28.83)
  Bottom Layer w0.254: 51.03,75.31 57.13,81.41 57.13,84.71 55.6,86.23 55.6,88.52 62.71,95.63 62.97,95.63 65.37,98.04 LED2.1 69.07,99.94 C2.2 ; 51.03,75.31 28.93,75.31 ; 51.03,75.31 53.25,73.09 53.25,70.81 52.23,69.79 52.23,66.74 54.01,64.97 54.01,63.7 54.77,62.93 55.53,62.93 55.79,62.68 59.34,62.68 59.6,62.93 ; 244.11,57.83 243.34,57.83 241.31,55.8 212.61,55.8 205.75,48.94 194.83,48.94 v1(194.58,49.19) 194.58,45.71 C9.2 ; 244.11,57.83 243.09,58.84 243.09,62.21 C10.2 244.77,75.06 238.01,81.82 238.01,86.9 238.77,87.66 ; 244.11,57.83 244.65,57.83 LED10.1 ; 109.01,42.96 109.01,43.72 111.48,46.19 C6.2 ; 109.01,42.96 96.82,55.15 81.83,55.15 77.86,59.12 60.36,59.12 60.11,58.87 59.34,59.63 59.34,61.66 59.6,61.92 59.6,62.93 ; 109.01,42.96 110.28,41.69 LED6.1 112.14,38.81 118.41,38.81 128.31,28.9 128.31,26.62 133.14,21.79 135.68,21.79 C7.2 136.69,23.32 136.69,27.66 LED7.1 v1(140,28.83) ; 238.77,87.66 239.28,88.17 239.28,95.97 238.01,97.24 238.77,98 238.77,102.22 C13.2 ; 238.77,87.66 241.82,84.61 247.15,84.61 249.44,86.9 249.44,87.92 251.72,90.2 251.72,93.5 254.01,95.79 276.61,95.79 ; C3.2 30.06,98.72 LED3.1 29.14,95.83 29.14,84.89 28.63,84.39 28.63,82.1 29.9,80.83 LED4.1 28.43,79.1 28.43,75.82 28.93,75.31 ; 276.61,95.79 LED12.1 277.63,96.73 277.63,100.95 276.77,101.8 ; 276.61,95.79 279.92,92.49 279.92,84.61 281.19,83.34 282.7,83.34 LED11.1 283.6,80.92 283.6,76.7 284.46,75.84 ; 59.6,62.93 60.56,62.93 C5.2 ; 180.35,82.47 180.35,81.2 v1(187.21,74.34) ; 180.35,82.47 180.87,82.47 184.43,86.02 184.43,87.29 183.41,88.31 176.81,88.31 176.55,88.56 176.55,89.83 177.06,90.34 182.29,90.34 LED14.1 ; 180.35,82.47 179.59,82.47 179.34,82.21 179.08,82.21 177.05,84.24 160.79,84.24 J3.3 ; 176.07,28.07 175.66,27.66 175.66,23.32 C8.2 ; 176.07,28.07 LED8.1 187.79,39.79 LED9.1 195.26,40.3 v1(196.03,40.3) ; 176.07,28.07 174.54,28.07 v1(173.78,28.83) ; 28.93,75.31 C4.2 ; C1.2 131.52,83.75 133.19,85.43 133.19,88.65 132.69,89.15 ; 132.69,89.15 132.57,89.16 ; 132.69,89.15 v1(144.62,89.15)
B4: length 51.6
  Bottom Layer w0.254: 162.42,59.73 161.66,59.73 159.88,61.51 145.4,61.51 144.9,61 144.9,56.68 SW38.A ; 162.42,59.73 166.48,59.73 SW37.A ; 162.42,59.73 162.42,76.49 163.44,77.51 163.44,79.55 U1.11
B5: length 27.1
  Bottom Layer w0.254: U1.12 161.32,78.11 SW38.B
COL0: length 307.3
  Top Layer w0.254: v1(185.56,88.55) v1(185.56,89.82) ; v1(164.22,94.36) 163.87,94.36 U1.5 v1(158.02,100.2) ; v1(198.81,41.9) v1(182.04,58.66) SW37.S2 183.28,61.93 v1(183.28,69.5)
  Bottom Layer w0.254: v1(198.81,41.9) 200,41.9 205.34,36.57 205.34,35.55 SW43.1 ; 9.43,71.87 12.73,75.18 12.73,90.63 16.04,93.94 16.04,109.39 18.79,112.14 29.5,112.14 30.11,111.53 31.34,111.53 31.34,110.3 32.54,109.09 51.09,109.09 54.64,112.65 87.66,112.65 90.96,109.35 111.54,109.35 112.81,108.08 118.9,108.08 120.43,106.55 142.53,106.55 144.3,104.78 147.61,104.78 152.18,100.2 v1(158.02,100.2) ; v1(183.28,69.5) 188.86,75.09 185.56,78.39 v1(185.56,88.55) ; v1(182.04,58.66) 189.83,58.66 192.17,56.33 ; v1(164.22,94.36) 164.47,94.61 184.79,94.61 185.56,93.85 ; v1(185.56,89.82) 185.56,93.84
COL1: length 320.4
  Top Layer w0.254: v1(148.68,84.62) 148.68,83.1 147.67,82.08 146.91,82.08 132.94,68.11 132.94,59.22 SW38.S2 126.33,52.62 82.24,52.62 44.72,90.14 34.81,90.14 ; 34.81,90.14 v1(34.81,99.79) ; 34.81,90.14 v1(29.99,85.31) v1(27.95,83.28) ; v1(207.02,91.94) v1(207.02,90.16) ; v1(214.4,57.47) v1(216.68,55.18) ; v1(210.33,76.23) v1(210.33,74.96)
  Bottom Layer w0.254: v1(34.81,99.79) 34.81,106.06 34.82,106.07 ; SW20.1 207.03,79.53 v1(210.33,76.23) ; v1(207.02,90.16) 207.02,81.82 ; SW32.1 210.33,61.53 v1(214.4,57.47) ; v1(216.68,55.18) 216.68,52.74 SW44.1 ; v1(210.33,74.96) 210.33,63.06 ; 28.21,68.55 27.19,69.56 27.19,82.52 v1(27.95,83.28) ; v1(29.99,85.31) 29.99,85.78 SW14.1 ; v1(148.68,84.62) 153.61,84.62 U1.6 164.12,95.12 172.75,95.12 178.09,100.46 203.6,100.46 SW8.1 203.72,99.05 207.02,95.75 v1(207.02,91.94)
COL2: length 346.6
  Top Layer w0.254: v1(228.49,83.01) v1(228.49,81.49) ; v1(225.18,102.03) 226.7,100.5 226.7,100.25 v1(225.94,99.49) 215.78,89.33 187.59,89.33 186.32,90.6 167.52,90.6 ; 167.52,90.6 v1(167.01,91.1) ; 167.52,90.6 167.01,90.09 167.01,71.04 168.66,69.4 168.66,54.9 161.68,47.92 v1(152.63,47.92) ; v1(50.67,74.67) 50.67,78.48 v1(51.43,79.24) ; v1(139.67,35.73) 122.65,35.73 117.28,30.36 117.06,30.36 116.89,30.19 114.65,30.19 114.61,30.15 113.64,30.15 113.6,30.19 107.12,30.19 91.16,46.15 v1(88.87,46.15) ; v1(54.74,95.46) v1(54.74,98.25)
  Bottom Layer w0.254: v1(51.43,79.24) 51.43,90.88 ; U1.7 162.64,91.1 v1(167.01,91.1) ; v1(152.63,47.92) 152.63,41.57 148.05,37 148.05,36.49 ; v1(225.18,102.03) 221.88,105.33 SW9.1 ; 148.05,36.49 148.05,35.22 SW45.1 ; 148.05,36.49 140.43,36.49 v1(139.67,35.73) ; v1(50.67,74.67) SW27.1 48.13,69.11 49.25,67.99 50.26,67.99 53.57,64.69 53.57,62.66 68.8,47.42 71.14,47.42 ; v1(54.74,95.46) 51.44,92.16 51.44,90.89 ; v1(225.94,99.49) 225.94,89.36 225.19,88.6 225.19,86.31 v1(228.49,83.01) ; v1(228.49,81.49) 228.49,69.85 ; 71.14,47.42 72.87,47.42 74.39,48.94 86.08,48.94 v1(88.87,46.15) ; 71.14,47.42 SW39.1 ; v1(54.74,98.25) 54.74,109.64
COL3: length 372
  Top Layer w0.254: v1(245.81,85.39) 245.81,83.36 v1(247.84,81.32) ; v1(73.36,94.88) 74.12,95.64 ; 74.12,95.64 v1(74.12,104.02) ; 74.12,95.64 81.48,88.27 133.56,88.27 134.06,87.76 134.83,87.76 146.76,99.7 150.9,99.7 162.34,88.27 164.88,90.81 v1(164.88,95.89) ; v1(244.54,98.31) 242.25,100.59 v1(242.25,105.16) ; v1(119.43,23.19) 114.6,28.02 v1(114.6,29.03) ; v1(70.81,65.19) v1(77.67,58.33)
  Bottom Layer w0.254: v1(244.54,98.31) 244.54,88.44 ; SW22.1 244.54,86.66 v1(245.81,85.39) ; 128.86,16.08 121.75,23.19 v1(119.43,23.19) ; v1(242.25,105.16) 241.23,106.18 SW10.1 241.23,107.94 235.37,113.8 230.55,113.8 228.28,111.53 211.26,111.53 200.69,100.97 174.43,100.97 171.48,103.91 171.12,103.91 164.88,97.66 v1(164.88,95.89) ; v1(74.12,104.02) 74.12,109.82 ; v1(77.67,58.33) 91.49,44.51 91.49,41.22 92,41.73 104.4,41.73 112.83,33.3 112.83,30.81 v1(114.6,29.03) ; v1(70.81,65.19) 67.51,68.49 67.51,87.76 70.82,91.07 70.82,92.34 v1(73.36,94.88) ; v1(247.84,81.32) 247.84,69.68
COL4: length 371.2
  Top Layer w0.254: v1(148,84.09) 147.5,84.6 146.73,84.6 145.41,83.27 94.35,83.27 90.6,79.52 v1(89.08,79.52) 89.08,79.01 90.85,77.23 90.85,64.28 89.84,63.26 v1(89.84,58.95) v1(95.17,53.61) ; v1(183.56,94) 193.98,104.41 210.49,104.41 212.01,102.89 238.94,102.89 244.27,97.55 244.78,97.55 248.33,101.11 ; 248.33,101.11 v1(254.43,95.01) ; 248.33,101.11 v1(248.84,101.62) ; v1(267.83,79.57) v1(267.83,71.44) ; v1(159.29,85.73) U1.9
  Bottom Layer w0.254: v1(95.17,53.61) SW41.1 121.83,34.56 127.88,28.52 127.88,26.23 132.96,21.15 142.86,21.15 147.94,16.07 ; v1(183.56,94) 179.75,94 175.44,89.68 162.23,89.68 159.18,86.63 159.18,85.62 ; SW29.1 85.77,65.45 85.77,62.13 88.96,58.95 v1(89.84,58.95) ; 159.18,85.62 158.16,85.62 156.39,83.84 148.26,83.84 v1(148,84.09) ; 159.18,85.62 v1(159.29,85.73) ; v1(267.83,79.57) 264.52,82.87 SW23.1 264.52,88.47 257.99,95.01 v1(254.43,95.01) ; v1(89.08,79.52) 89.08,84.22 88.98,84.31 92.29,87.62 SW5.1 ; SW11.1 257.9,100.35 250.11,100.35 v1(248.84,101.62) ; v1(267.83,71.44) 267.83,66.15
COL5: length 370.7
  Top Layer w0.254: v1(161.07,83.44) 156.24,83.44 147.61,92.08 146.84,92.08 145.83,93.09 145.83,96.3 v1(146.08,96.56) ; v1(167.74,77.84) 170.02,75.55 170.02,62.6 197.96,34.66 v1(197.96,25.77) 207.61,25.77 235.05,53.2 270.35,53.2 v1(278.48,61.33) ; v1(105.34,74.49) v1(104.33,73.48) ; v1(108.14,92.75) v1(107.13,91.73)
  Bottom Layer w0.254: SW12.1 279.99,105.45 283.8,101.64 287.1,101.64 287.61,101.13 287.61,92.53 SW24.1 283.3,86.69 287.11,82.88 290.41,82.88 290.92,82.37 290.92,73.77 SW36.1 v1(278.48,61.33) ; v1(107.13,91.73) 107.13,77.55 ; SW18.1 107.12,76.27 v1(105.34,74.49) ; v1(108.14,92.75) 110.43,95.03 SW6.1 113.22,99.1 123.98,99.1 128.05,95.03 144.56,95.03 v1(146.08,96.56) ; v1(161.07,83.44) 161.32,83.19 162.34,83.19 167.69,77.84 v1(167.74,77.84) ; v1(197.96,25.77) 197.96,25.51 196.69,24.24 194.91,24.24 194.66,24.5 189.07,24.5 188.31,23.73 186.52,23.73 184.62,25.64 179.54,20.56 171.49,20.56 SW48.1 ; SW30.1 104.33,59.3 v1(104.33,73.48)
D2: length 39.5
  Bottom Layer w0.254: U1.2 150.78,91.94 146.19,91.94 127.75,90.01
D3: length 54.3
  Top Layer w0.254: U1.1 166.4,101.98 166.4,62.36 167.93,60.84 167.93,56.08 SW37.B
DOUT: length 34.1
  Bottom Layer w0.254: J3.2 161.73,87.18 179.01,87.18 179.26,86.93 183.11,86.93
NET-(D1-PAD2): length 11.7
  Bottom Layer w0.254: 23.32,100.38 23.37,100.43 23.37,103.05 29.22,108.89 29.22,109.65
NET-(D2-PAD2): length 12.4
  Top Layer w0.254: v1(42.92,97.05) 43.17,97.3 v1(43.17,98.45)
  Bottom Layer w0.254: v1(43.17,98.45) 42.91,98.71 42.91,100.48 47.99,105.56 47.99,106.33 ; v1(42.91,97.05) D2.2
NET-(D3-PAD2): length 11.7
  Bottom Layer w0.254: SW3.2 63.6,105.59 63.6,102.2 D3.2
NET-(D4-PAD2): length 11.7
  Bottom Layer w0.254: D4.2 81.45,100.86 81.45,103.48 87.3,109.32 SW4.2
NET-(D5-PAD2): length 11.9
  Bottom Layer w0.254: SW5.2 101.15,99.01 101.15,95.68 99.44,93.97
NET-(D6-PAD2): length 17.3
  Top Layer w0.254: v1(125.89,93.77) v1(125.89,88.94)
  Bottom Layer w0.254: SW6.2 123.6,96.05 v1(125.89,93.77) ; 117.83,87.2 124.15,87.2 v1(125.89,88.94)
NET-(D7-PAD2): length 11.5
  Bottom Layer w0.254: D7.2 195.44,96.19 197.85,98.6
NET-(D8-PAD2): length 11.5
  Bottom Layer w0.254: D8.2 213.6,102.92 SW8.2
NET-(D9-PAD2): length 11.5
  Bottom Layer w0.254: SW9.2 231.76,109.7 D9.2
NET-(D10-PAD2): length 11.5
  Bottom Layer w0.254: 251.12,101.46 251.12,109.54 SW10.2
NET-(D11-PAD2): length 11.5
  Top Layer w0.254: v1(271.1,101.18) v1(271.1,99.66)
  Bottom Layer w0.254: 273.51,108.41 271.1,106 v1(271.1,101.18) ; v1(271.1,99.65) D11.2
NET-(D12-PAD2): length 11.5
  Bottom Layer w0.254: 292.28,111.72 289.87,109.31 D12.2
NET-(D13-PAD2): length 11.7
  Bottom Layer w0.254: D13.2 20.07,81.67 20.07,84.29 25.91,90.13 SW13.2
NET-(D14-PAD2): length 11.7
  Bottom Layer w0.254: 44.69,87.57 40.37,83.25 40.37,79.86 D14.2
NET-(D15-PAD2): length 11.7
  Bottom Layer w0.254: 64.61,91.14 64.61,90.38 58.77,84.54 58.77,81.92 D15.2
NET-(D16-PAD2): length 11.7
  Bottom Layer w0.254: D16.2 78.15,82.1 78.15,84.72 83.99,90.56 SW16.2
NET-(D17-PAD2): length 11.7
  Bottom Layer w0.254: SW17.2 102.16,83.81 96.32,77.96 96.32,75.34 96.27,75.29
NET-(D18-PAD2): length 11.7
  Bottom Layer w0.254: 114.4,68.52 114.45,68.57 114.45,71.2 120.29,77.04 SW18.2
NET-(D19-PAD2): length 11.5
  Bottom Layer w0.254: D19.2 198.74,77.42 SW19.2
NET-(D20-PAD2): length 11.5
  Bottom Layer w0.254: SW20.2 216.91,84.16 216.91,76.08
NET-(D21-PAD2): length 11.5
  Bottom Layer w0.254: SW21.2 235.07,90.94 D21.2
NET-(D22-PAD2): length 11.5
  Bottom Layer w0.254: SW22.2 254.42,90.77 254.42,82.7
NET-(D23-PAD2): length 11.5
  Bottom Layer w0.254: D23.2 274.41,87.25 276.82,89.65
NET-(D24-PAD2): length 11.5
  Bottom Layer w0.254: SW24.2 293.18,90.55 D24.2
NET-(D25-PAD2): length 10.9
  Bottom Layer w0.254: SW25.2 22.6,71.37 16.84,65.61 D25.2
NET-(D26-PAD2): length 10.9
  Bottom Layer w0.254: 41.38,68.8 41.38,68.04 35.62,62.28 35.62,60.28
NET-(D27-PAD2): length 10.9
  Bottom Layer w0.254: D27.2 55.54,65.86 61.3,71.62 SW27.2
NET-(D28-PAD2): length 10.9
  Bottom Layer w0.254: 80.68,72.56 80.68,71.8 74.92,66.04 D28.2
NET-(D29-PAD2): length 10.9
  Bottom Layer w0.254: D29.2 93.09,59.28 98.85,65.04 98.85,65.81
NET-(D30-PAD2): length 10.9
  Bottom Layer w0.254: SW30.2 112.67,54.72 112.67,51.95 D30.2
NET-(D31-PAD2): length 11.5
  Bottom Layer w0.254: D31.2 202.05,58.67 SW31.2
NET-(D32-PAD2): length 11.5
  Bottom Layer w0.254: D32.2 220.22,65.4 SW32.2
NET-(D33-PAD2): length 13.6
  Bottom Layer w0.254: D33.2 237.23,65.25 237.23,66.05 238.26,67.08 238.26,68.99 237.23,70.02 237.23,71.03 237.85,71.65 238.33,71.65 239.4,72.72 239.4,73.2 240.78,74.59
NET-(D34-PAD2): length 11.5
  Bottom Layer w0.254: 257.73,63.94 257.73,71.52 260.14,73.93 260.14,74.42
NET-(D35-PAD2): length 11.5
  Bottom Layer w0.254: 277.71,60.41 277.71,68.48 280.12,70.89
NET-(D36-PAD2): length 11.5
  Bottom Layer w0.254: SW36.2 296.49,71.79 D36.2
NET-(D37-PAD2): length 10
  Bottom Layer w0.254: SW37.S1 181.03,52.59 D37.2
NET-(D38-PAD2): length 16.6
  Bottom Layer w0.254: D38.2 134.05,50.25 133.59,50.25 133.45,50.4 133.45,54.57 SW38.S1
NET-(D39-PAD2): length 11.8
  Bottom Layer w0.254: 77.03,37.08 77.03,39.62 83.04,45.64 SW39.2
NET-(D40-PAD2): length 11
  Bottom Layer w0.254: SW40.2 103.5,38.06 D40.2
NET-(D41-PAD2): length 11.3
  Bottom Layer w0.254: SW41.2 122.2,28.2 117.63,23.63 116.47,23.63 D41.2
NET-(D42-PAD2): length 12
  Bottom Layer w0.254: SW42.2 192.89,31.07 196.19,27.77 196.19,25.43 D42.2
NET-(D43-PAD2): length 10.8
  Bottom Layer w0.254: SW43.2 216.24,32.44 D43.2
NET-(D44-PAD2): length 11.5
  Bottom Layer w0.254: SW44.2 235.7,45.76 235.7,37.76
NET-(D45-PAD2): length 11.4
  Bottom Layer w0.254: 160.88,37.67 160.88,35.13 156.65,30.9 D45.2
NET-(D46-PAD2): length 11.8
  Bottom Layer w0.254: D46.2 137.47,8.81 137.47,11.76 141.78,16.08 SW46.2
NET-(D47-PAD2): length 11.7
  Bottom Layer w0.254: SW47.2 160.87,16.07 156.65,11.86 D47.2
NET-(D48-PAD2): length 11.6
  Bottom Layer w0.254: D48.2 175.96,12.1 179.94,16.08 SW48.2
NET-(J2-PAD1): length 50.2
  Bottom Layer w0.254: 195.26,104.17 193.23,106.2 163.76,106.2 162.75,107.21 152.84,107.21 JN.1 ; 195.26,104.17 196.2,103.23 SW_TOG1.2 ; 195.26,104.17 195.26,104.36 SW49.2
NET-(LED1-PAD2): length 66.1
  Top Layer w0.254: v1(107.81,86.01) 106.28,87.53 v1(91.3,87.53)
  Bottom Layer w0.254: 132.01,86.01 130.24,87.79 126.35,87.79 124.57,86.01 v1(107.81,86.01) ; v1(91.3,87.53) 81.65,97.19 71.99,97.19
NET-(LED2-PAD2): length 36.9
  Bottom Layer w0.254: 32.98,95.97 54.38,95.97 54.63,96.22 62.76,96.22 67.73,101.19
NET-(LED3-PAD2): length 21.2
  Bottom Layer w0.254: LED4.4 28.64,84.98 28.64,94.64 26.86,96.41 26.86,98.12 28.71,99.97
NET-(LED4-PAD2): length 45
  Top Layer w0.254: v1(43.57,75.9) 43.57,73.62 v1(55,62.19)
  Bottom Layer w0.254: LED4.2 31.38,75.9 v1(43.57,75.9) ; LED5.4 64.68,57.76 59.42,57.76 v1(55,62.18)
NET-(LED5-PAD2): length 63.6
  Top Layer w0.254: v1(110.03,42.87) v1(108.5,44.4)
  Bottom Layer w0.254: v1(108.5,44.4) 97.32,55.57 90.47,55.57 85.9,60.14 62.54,60.14 LED5.2 ; v1(110.02,42.87) 113.07,39.82 115.1,39.82
NET-(LED6-PAD2): length 28.3
  Bottom Layer w0.254: LED6.2 112.63,42.04 119.76,42.04 LED7.4
NET-(LED7-PAD2): length 37.3
  Top Layer w0.254: v1(155.04,28.83) 154.89,28.68 v1(152.35,28.68)
  Bottom Layer w0.254: LED7.2 149.3,25.63 v1(152.34,28.68) ; LED8.4 170.15,27.05 156.05,27.05 155.04,28.07 v1(155.04,28.83)
NET-(LED8-PAD2): length 29
  Bottom Layer w0.254: LED9.4 197.78,38.84 190.04,38.84 LED8.2
NET-(LED10-PAD2): length 44.8
  Bottom Layer w0.254: 279.54,80.83 276.16,77.45 272.76,77.45 258.28,62.97 257.26,62.97 255.74,64.5 253.2,64.5 249.64,60.94 244.56,60.94 LED10.2
NET-(LED10-PAD4): length 68.7
  Bottom Layer w0.254: LED9.2 194.46,42.69 211.64,42.69 213.92,44.97 216.97,44.97 221.8,40.15 228.91,40.15 229.67,40.91 229.67,41.93 231.15,43.4 231.15,46.45 234.7,50.01 240.8,50.01 LED10.4
NET-(LED11-PAD2): length 20.3
  Bottom Layer w0.254: LED12.4 281.44,96.56 281.44,86.32 285.5,82.26 285.5,79.11 LED11.2
NET-(LED12-PAD2): length 36.2
  Bottom Layer w0.254: LED13.4 243.86,99.12 264.44,99.12 267.23,96.32 273.52,96.32 LED12.2
NET-(LED13-PAD2): length 67.1
  Top Layer w0.254: v1(205.92,95.83) 217.1,95.83 v1(221.65,100.39)
  Bottom Layer w0.254: 177.73,89.23 178.24,88.72 182.81,88.72 183.32,89.23 192.72,89.23 195,86.95 197.03,86.95 v1(205.92,95.84) ; 237.45,100.39 236.94,99.88 228.26,99.88 227.75,100.39 v1(221.65,100.39)
RAW: length 50.5
  Bottom Layer w0.254: SW_TOG1.1 193.39,102.43 SW49.3 193.29,104.7 160.2,104.7 159.29,103.78 149.38,103.78 U1.24
ROW0: length 159.1
  Top Layer w0.254: v1(92.89,97.85) 84,97.85 v1(80.44,101.4)
  Bottom Layer w0.254: 41.91,98.15 39.38,98.15 D2.1 ; 41.91,98.15 42.49,98.15 42.99,97.64 55.37,97.64 58.93,101.2 ; 41.91,98.15 41.91,99.17 41.42,99.66 40.12,99.66 39.85,99.93 39.34,99.93 38.86,100.41 38.86,103.35 39.88,104.37 39.88,106.28 38.35,107.8 32.26,107.8 23.87,99.42 21.59,99.42 D1.1 ; 58.93,101.2 D3.1 ; 58.93,101.2 59.94,101.2 61.47,99.68 63.24,99.68 68.58,105.01 72.13,105.01 75.77,101.38 D4.1 78.18,101.4 v1(80.44,101.4) ; U1.20 143.31,92.08 128.07,92.08 124.26,88.27 115.07,88.27 D6.1 112.04,87.78 106.96,92.86 97.87,92.86 D5.1 v1(92.89,97.85)
ROW1: length 158.4
  Top Layer w0.254: v1(164.86,87.79) 164.1,87.03 153.43,87.03 U1.19 ; v1(181.88,87.54) v1(186.2,87.54)
  Bottom Layer w0.254: v1(181.88,87.54) 181.63,87.79 v1(164.87,87.79) ; v1(186.2,87.54) D7.1 193.2,86.52 202.44,86.52 210.19,94.27 210.35,94.27 210.86,93.76 214.16,93.76 221.45,101.05 D9.1 228.93,100.63 233.5,100.63 237.82,104.95 241.63,104.95 245.69,100.89 D10.1 249.14,99.62 265.59,99.62 267.85,97.36 270.9,100.41 273.44,100.41 276.74,103.71 280.3,103.71 283.34,100.67 D12.1
ROW2: length 151.9
  Top Layer w0.254: v1(71.62,82.44) v1(56.38,82.44) ; v1(29.45,82.16) v1(23.61,82.16)
  Bottom Layer w0.254: v1(23.61,82.16) 22.08,80.64 18.31,80.64 D13.1 ; v1(29.45,82.16) 32.24,82.16 D14.1 37.3,77.11 50.13,77.11 55.47,82.44 v1(56.38,82.44) ; v1(71.62,82.44) 71.8,82.62 D16.1 81.6,75.86 D17.1 94.7,74.17 104.55,74.17 109.63,69.09 D18.1 112.67,67.57 123.88,67.57 U1.18
ROW3: length 163.5
  Top Layer w0.254: v1(237.32,82.13) v1(238.84,82.13) ; v1(280.3,81.9) v1(286.14,81.9) ; 147.12,88.27 v1(156.52,78.87)
  Bottom Layer w0.254: v1(156.52,78.87) 159.56,81.92 162.61,81.92 175.75,68.78 D19.1 196,68.27 202.35,68.27 209.72,75.63 213.53,75.63 213.66,75.51 214.16,75 217.47,75 224.76,82.29 231.82,82.29 232.24,81.87 237.06,81.87 v1(237.32,82.13) ; D24.1 289.92,81.9 v1(286.14,81.9) ; v1(280.3,81.9) 278.77,81.9 274.97,78.09 271.66,78.09 D23.1 254.7,78.6 D22.1 v1(238.84,82.13)
ROW4: length 163.2
  Top Layer w0.254: v1(66.34,64.61) 63.29,61.56 54.65,61.56 v1(52.88,63.34)
  Bottom Layer w0.254: 13.59,64.18 16.91,60.85 32.37,60.85 33.89,59.33 37.43,59.33 42.46,64.35 51.86,64.35 52.37,63.85 ; v1(52.87,63.34) 52.37,63.85 ; 52.37,63.85 52.37,64.35 D27.1 ; U1.16 116.64,55.25 116.64,53.72 112.48,49.56 109.5,49.56 D30.1 102.9,56.16 91.52,56.16 D29.1 89.08,57.85 84.38,62.55 72.97,62.55 71.67,63.85 D28.1 v1(66.34,64.61)
ROW5: length 172.3
  Top Layer w0.254: v1(153.98,80.39) v1(163.12,71.25) ; v1(243.42,63.37) v1(253.07,63.37)
  Bottom Layer w0.254: v1(243.42,63.37) 243.16,63.11 235.54,63.11 D33.1 227.84,56.24 217.47,56.24 216.97,56.75 212.9,56.75 205.66,49.51 199.31,49.51 D31.1 188.67,50.02 179.63,59.06 179.63,60.33 168.71,71.25 v1(163.12,71.25) ; D36.1 289.42,59.33 274.97,59.33 D35.1 272.24,59.83 267.69,64.38 264.9,64.38 262.86,62.35 255.5,62.35 254.48,63.37 v1(253.07,63.37) ; 147.12,83.19 151.18,83.19 v1(153.98,80.39)
ROW6: length 190.7
  Top Layer w0.254: v1(192.84,23.75) 189.28,27.31 189.28,28.32 170.49,47.12 v1(168.96,47.12) 135.94,47.12 v1(133.91,49.15) ; v1(133.91,49.15) 133.91,49.91 133.4,50.42 133.4,66.93 U1.14 ; v1(133.91,49.15) v1(118.67,33.91)
  Bottom Layer w0.254: 113.84,26.8 113.84,25.65 D41.1 ; 113.84,26.8 98.76,26.8 D40.1 79.18,32.25 D39.1 ; 113.84,26.8 115.11,28.07 115.11,28.58 116.89,30.35 117.4,30.35 118.67,31.62 v1(118.67,33.91) ; v1(133.91,49.15) 133.91,47.08 D38.1 ; v1(192.84,23.75) 193.21,23.75 193.74,23.22 ; D37.1 172,47.12 v1(168.96,47.12)
ROW7: length 187.2
  Top Layer w0.254: U1.13 147.12,62.36 v1(145.6,60.84)
  Bottom Layer w0.254: D47.1 154.37,7.68 171.64,7.68 D48.1 173.67,7.68 190.21,7.68 213.43,30.9 226.17,30.9 D44.1 ; D47.1 152.34,7.68 135.07,7.68 D46.1 ; D47.1 152.59,9.46 152.59,14.54 153.35,15.3 D45.1 153.35,30.98 152.59,31.74 152.59,33.52 153.35,34.28 153.35,53.07 v1(145.59,60.83)
RST: length 30.5
  Bottom Layer w0.254: 147.12,100.97 142.21,105.87 Reset1.1

## Copper pours and planes (outline as drawn; the poured copper is in the pictures)
VCC on Bottom Layer: 136.74,28.72 136.83,28.65 136.91,28.61 136.99,28.59 137.07,28.58 137.15,28.58 137.22,28.58 137.3,28.58 137.37,28.57 137.44,28.53 137.51,28.48 138.12,28.83 137.65,29.28 137.58,29.24 137.51,29.18 137.45,29.12 137.39,29.06 137.33,29.01 137.27,28.96 137.22,28.94 137.16,28.93 137.09,28.95 137.02,29.01
VCC on Bottom Layer: 30.74,101.22 30.74,101.5 30.72,102.2 30.72,102.34 29.82,102.57 29.86,101.71 29.94,101.68 30.02,101.65 30.09,101.63 30.15,101.59 30.21,101.56 30.25,101.51 30.29,101.46 30.32,101.39 30.34,101.31 30.34,101.22
VCC on Bottom Layer: 175.57,21.76 175.69,21.88 175.78,21.97 176.2,22.41 176.28,22.5 176.38,22.6 175.96,23.39 175.28,22.86 175.32,22.76 175.39,22.59 175.42,22.51 175.44,22.44 175.44,22.36 175.44,22.29 175.41,22.21 175.36,22.13 175.29,22.05
VCC on Bottom Layer: 277.9,101.06 277.79,101.18 277.71,101.28 277.65,101.38 277.6,101.47 277.56,101.56 277.53,101.65 277.5,101.75 277.47,101.85 277.43,101.96 277.37,102.09 276.51,102.01 276.62,101.16 276.75,101.13 276.86,101.12 276.96,101.1 277.06,101.09 277.15,101.07 277.23,101.05 277.32,101.01 277.41,100.95 277.51,100.88 277.62,100.78
VCC on Bottom Layer: 60.95,58.31 60.87,58.39 60.81,58.47 60.76,58.53 60.73,58.6 60.7,58.66 60.68,58.73 60.61,58.95 60.58,59.04 59.93,59.05 59.94,58.4 60.03,58.37 60.25,58.3 60.32,58.28 60.38,58.25 60.45,58.22 60.51,58.17 60.59,58.11 60.67,58.03
VCC on Bottom Layer: 277.43,96.81 277.35,96.73 277.28,96.67 277.21,96.62 277.15,96.59 277.08,96.56 277.02,96.54 276.8,96.47 276.71,96.44 276.69,95.79 277.34,95.8 277.37,95.89 277.44,96.11 277.46,96.17 277.49,96.24 277.53,96.3 277.58,96.37 277.64,96.44 277.72,96.53
VCC on Bottom Layer: 27.41,74.29 27.52,74.39 27.61,74.46 27.7,74.52 27.79,74.55 27.88,74.58 27.97,74.6 28.06,74.61 28.16,74.62 28.28,74.64 28.4,74.67 28.51,75.52 27.65,75.6 27.6,75.47 27.56,75.36 27.52,75.25 27.49,75.16 27.46,75.07 27.43,74.98 27.38,74.89 27.32,74.79 27.23,74.69 27.13,74.57
VCC on Bottom Layer: 275.88,95.77 275.99,95.76 276.09,95.76 276.17,95.74 276.24,95.72 276.3,95.7 276.36,95.67 276.57,95.56 276.65,95.52 277.12,95.97 276.65,96.42 276.57,96.38 276.43,96.3 276.36,96.27 276.3,96.24 276.24,96.21 276.17,96.19 276.09,96.18 275.99,96.17 275.88,96.17
VCC on Bottom Layer: 245.42,58.89 245.34,58.81 245.27,58.75 245.2,58.7 245.14,58.67 245.07,58.64 245.01,58.61 244.94,58.59 244.79,58.55 244.7,58.52 244.69,57.87 245.34,57.88 245.37,57.97 245.43,58.19 245.46,58.26 245.48,58.32 245.52,58.38 245.57,58.45 245.63,58.52 245.71,58.6
VCC on Bottom Layer: 283.37,81.48 283.48,81.48 283.58,81.47 283.66,81.46 283.73,81.44 283.8,81.41 283.86,81.38 283.92,81.35 284.06,81.27 284.14,81.23 284.61,81.68 284.14,82.13 284.06,82.09 283.92,82.01 283.86,81.98 283.8,81.95 283.73,81.93 283.66,81.91 283.58,81.89 283.48,81.89 283.37,81.88
VCC on Bottom Layer: 277.71,95.41 277.63,95.49 277.57,95.56 277.53,95.63 277.49,95.7 277.46,95.76 277.44,95.82 277.37,96.04 277.34,96.13 276.69,96.14 276.71,95.5 276.8,95.47 276.95,95.42 277.01,95.4 277.08,95.38 277.14,95.35 277.21,95.31 277.27,95.26 277.35,95.2 277.43,95.13
